# EAGLE design DataControlBoard-RPi (EAGLE 9.4.2)
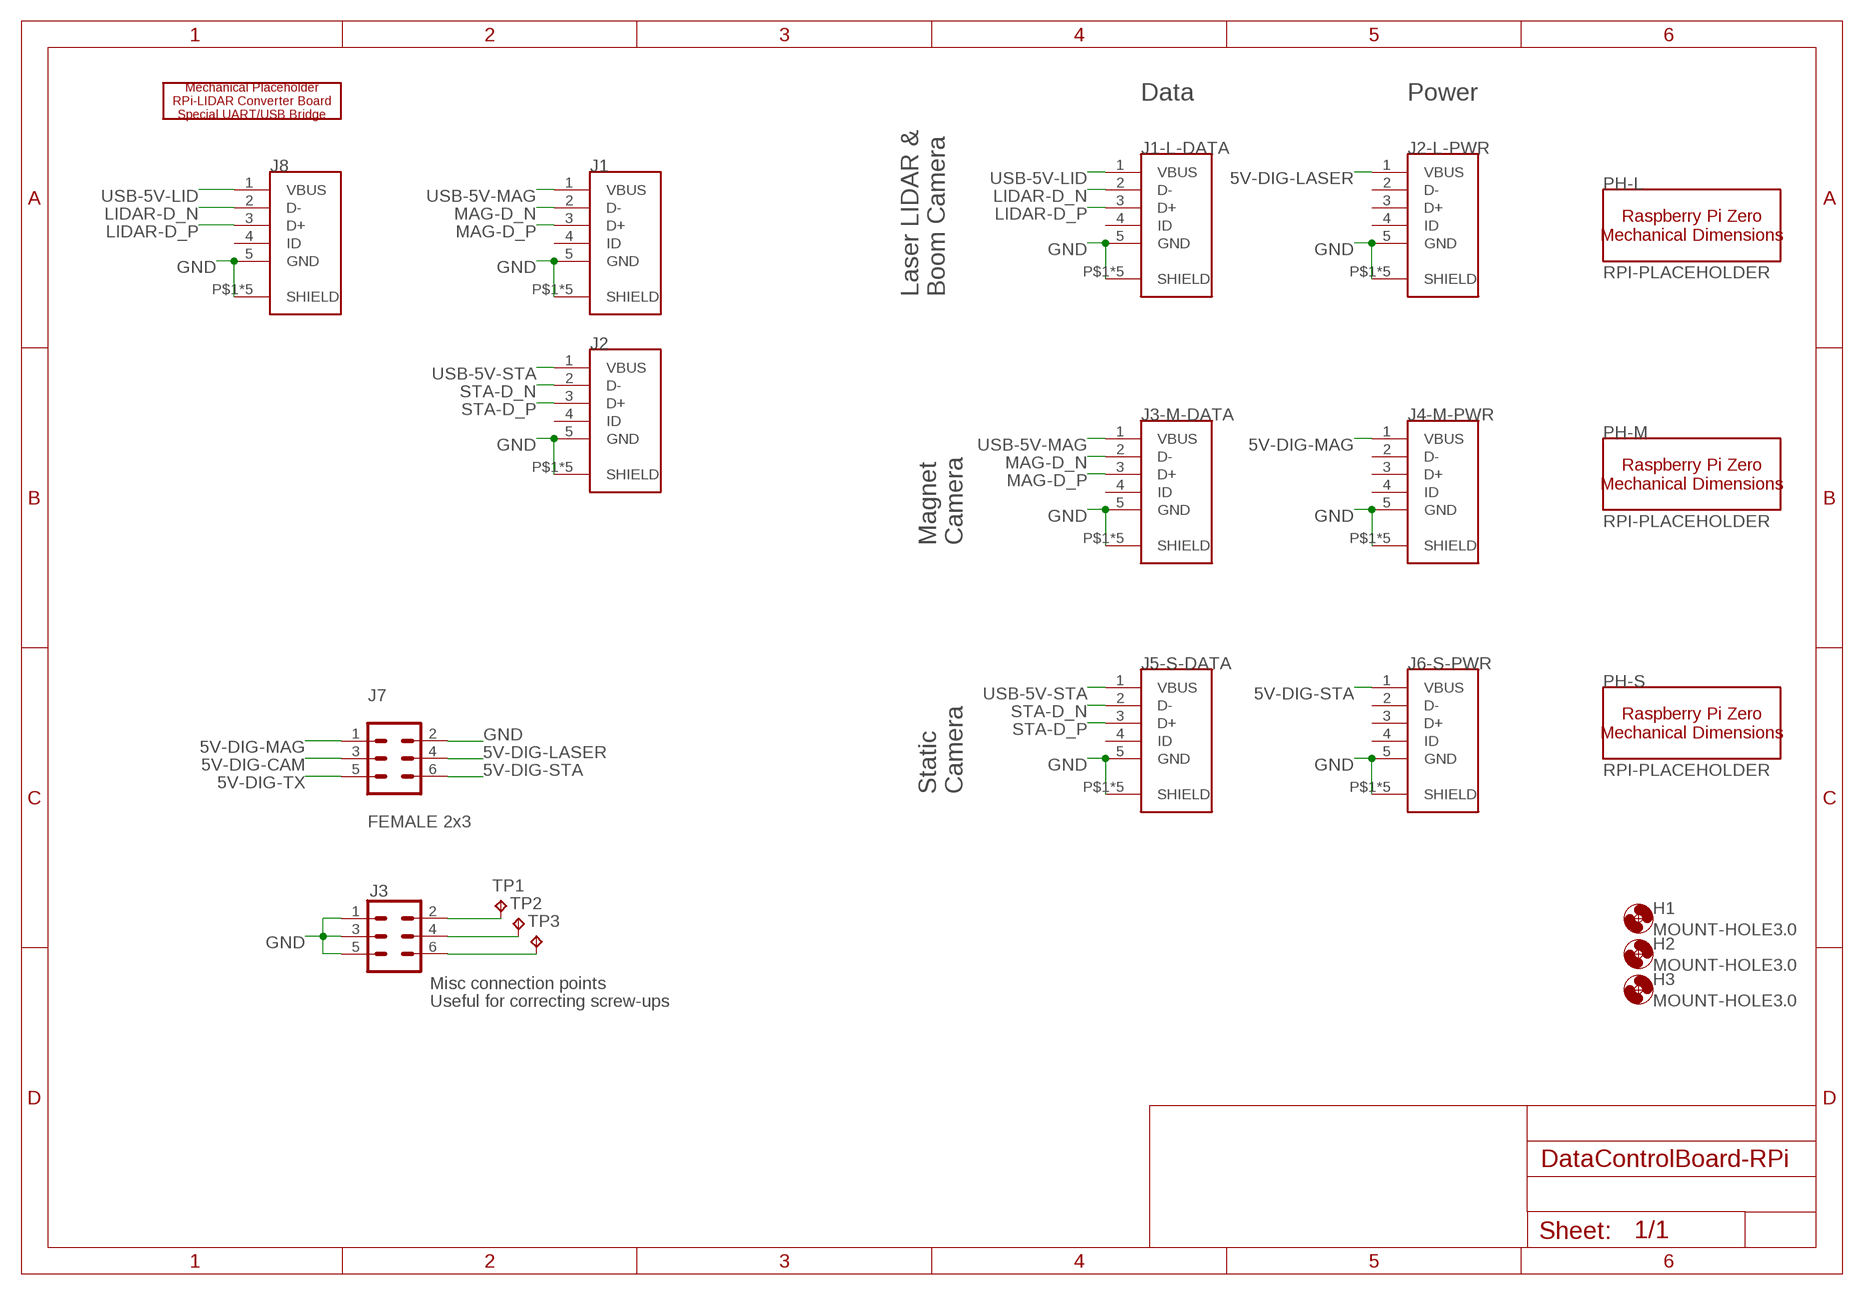
[diagram p0: schematic, sheet 1]

## Parts
H1  MOUNT-HOLE3.0  [3,0]
H2  MOUNT-HOLE3.0  [3,0]
H3  MOUNT-HOLE3.0  [3,0]
J1  USB3150-30-130-AMANUFACTURABLE  [GCT_USB3150-30-EASIER]
J1-L-DATA  USB3150-30-130-AMANUFACTURABLE  [GCT_USB3150-30-EASIER]
J2  USB3150-30-130-AMANUFACTURABLE  [GCT_USB3150-30-EASIER]
J2-L-PWR  USB3150-30-130-AMANUFACTURABLE  [GCT_USB3150-30-EASIER]
J3  CONN_03X22X3_SILK_MALE_PTH  [2X3]
J3-M-DATA  USB3150-30-130-AMANUFACTURABLE  [GCT_USB3150-30-EASIER]
J4-M-PWR  USB3150-30-130-AMANUFACTURABLE  [GCT_USB3150-30-EASIER]
J5-S-DATA  USB3150-30-130-AMANUFACTURABLE  [GCT_USB3150-30-EASIER]
J6-S-PWR  USB3150-30-130-AMANUFACTURABLE  [GCT_USB3150-30-EASIER]
J7  FEMALE 2x3  CONN_03X2FEMALE  [2X3]
J8  USB3150-30-130-AMANUFACTURABLE  [GCT_USB3150-30-EASIER]
PH-L  RPI-PLACEHOLDER  [RPI-ZERO-EDGE]
PH-M  RPI-PLACEHOLDER  [RPI-ZERO-EDGE]
PH-S  RPI-PLACEHOLDER  [RPI-ZERO-EDGE]
TP1  TPPAD1-17  [P1-17]
TP2  TPPAD1-17  [P1-17]
TP3  TPPAD1-17  [P1-17]
U$4  LIDAR-CONV-PLACEHOLDER  [LIDAR-PLACEHOLDER]

## Nets
5V-DIG-CAM: J7.3
5V-DIG-LASER: J2-L-PWR.1(VBUS) J7.4
5V-DIG-MAG: J4-M-PWR.1(VBUS) J7.1
5V-DIG-STA: J6-S-PWR.1(VBUS) J7.6
5V-DIG-TX: J7.5
GND: J1-L-DATA.5(GND) J1-L-DATA.P$1(SHIELD) J1-L-DATA.S3(SHIELD) J1-L-DATA.S4(SHIELD) J1-L-DATA.S5(SHIELD) J1-L-DATA.S6(SHIELD) J1.5(GND) J1.P$1(SHIELD) J1.S3(SHIELD) J1.S4(SHIELD) J1.S5(SHIELD) J1.S6(SHIELD) J2-L-PWR.5(GND) J2-L-PWR.P$1(SHIELD) J2-L-PWR.S3(SHIELD) J2-L-PWR.S4(SHIELD) J2-L-PWR.S5(SHIELD) J2-L-PWR.S6(SHIELD) J2.5(GND) J2.P$1(SHIELD) J2.S3(SHIELD) J2.S4(SHIELD) J2.S5(SHIELD) J2.S6(SHIELD) J3-M-DATA.5(GND) J3-M-DATA.P$1(SHIELD) J3-M-DATA.S3(SHIELD) J3-M-DATA.S4(SHIELD) J3-M-DATA.S5(SHIELD) J3-M-DATA.S6(SHIELD) J3.1 J3.3 J3.5 J4-M-PWR.5(GND) J4-M-PWR.P$1(SHIELD) J4-M-PWR.S3(SHIELD) J4-M-PWR.S4(SHIELD) J4-M-PWR.S5(SHIELD) J4-M-PWR.S6(SHIELD) J5-S-DATA.5(GND) J5-S-DATA.P$1(SHIELD) J5-S-DATA.S3(SHIELD) J5-S-DATA.S4(SHIELD) J5-S-DATA.S5(SHIELD) J5-S-DATA.S6(SHIELD) J6-S-PWR.5(GND) J6-S-PWR.P$1(SHIELD) J6-S-PWR.S3(SHIELD) J6-S-PWR.S4(SHIELD) J6-S-PWR.S5(SHIELD) J6-S-PWR.S6(SHIELD) J7.2 J8.5(GND) J8.P$1(SHIELD) J8.S3(SHIELD) J8.S4(SHIELD) J8.S5(SHIELD) J8.S6(SHIELD)
LIDAR-D_N [USB_diff]: J1-L-DATA.2(D-) J8.2(D-)
LIDAR-D_P [USB_diff]: J1-L-DATA.3(D+) J8.3(D+)
MAG-D_N [USB_diff]: J1.2(D-) J3-M-DATA.2(D-)
MAG-D_P [USB_diff]: J1.3(D+) J3-M-DATA.3(D+)
N$2: J3.2 TP1.TP
N$3: J3.4 TP2.TP
N$4: J3.6 TP3.TP
STA-D_N [USB_diff]: J2.2(D-) J5-S-DATA.2(D-)
STA-D_P [USB_diff]: J2.3(D+) J5-S-DATA.3(D+)
USB-5V-LID: J1-L-DATA.1(VBUS) J8.1(VBUS)
USB-5V-MAG: J1.1(VBUS) J3-M-DATA.1(VBUS)
USB-5V-STA: J2.1(VBUS) J5-S-DATA.1(VBUS)
Unconnected: J1-L-DATA.4(ID) J1.4(ID) J2-L-PWR.2(D-) J2-L-PWR.3(D+) J2-L-PWR.4(ID) J2.4(ID) J3-M-DATA.4(ID) J4-M-PWR.2(D-) J4-M-PWR.3(D+) J4-M-PWR.4(ID) J5-S-DATA.4(ID) J6-S-PWR.2(D-) J6-S-PWR.3(D+) J6-S-PWR.4(ID) J8.4(ID)

## Notes on the sheet
- Data | Power
- Laser LIDAR &
  Boom Camera
- Magnet 
  Camera
- Static
  Camera
- Misc connection points
- Useful for correcting screw-ups

## Library data of the parts
H1-H3 = holes:MOUNT-HOLE: MOUNTING HOLE with drill center marker
J1 J1-L-DATA J2 J2-L-PWR J3-M-DATA J4-M-PWR J5-S-DATA J6-S-PWR J8 = RPi-Parts:USB3150-30-130-A: Vertical Through Hole Type B Micro USB Plug w/ Shell Stakes and Pegs
J3 = SparkFun-Connectors:CONN_03X2: Multi connection point. Often used as Generic Header-pin footprint for 0.1 inch spaced/style header connections You can populate with any combo of single row headers, but if you'd like an exact match, check these: Header - 2x3 (Male, 0.1") <https://www.sparkfun.com/products/12807> (PRT-12807) Header - 2x3 (Female, 0.1") <https://www.sparkfun.com/products/13010> (PRT-13010) 2x3 Pin Shrouded Header <https://www.sparkfun.com/products/10877> (PRT-10877) On any of the 0.1 inch spaced packages, you can populate with these: Break Away Headers - Straight <https://www.sparkfun.com/products/116> (PRT-00116) Break Away Male Headers - Right Angle <https://www.sparkfun.com/products/553> (PRT-00553) Female Headers <https://www.sparkfun.com/products/115> (PRT-00115) Break Away Headers - Machine Pin <https://www.sparkfun.com/products/117> (PRT-00117) Break Away Female Headers - Swiss Machine Pin <https://www.sparkfun.com/products/743> (PRT-00743) Special note: the shrouded connector mates well with our 3x2 ribbon cables: Ribbon Crimp Connector - 6-pin (2x3, Female) <https://www.sparkfun.com/products/10651> (PRT-10651) Ribbon Cable - 6 wire (15ft) <https://www.sparkfun.com/products/10646> (PRT-10646); PROD_ID: CONN-09701
J7 = SparkFun-Connectors:CONN_03X2: Multi connection point. Often used as Generic Header-pin footprint for 0.1 inch spaced/style header connections You can populate with any combo of single row headers, but if you'd like an exact match, check these: Header - 2x3 (Male, 0.1") <https://www.sparkfun.com/products/12807> (PRT-12807) Header - 2x3 (Female, 0.1") <https://www.sparkfun.com/products/13010> (PRT-13010) 2x3 Pin Shrouded Header <https://www.sparkfun.com/products/10877> (PRT-10877) On any of the 0.1 inch spaced packages, you can populate with these: Break Away Headers - Straight <https://www.sparkfun.com/products/116> (PRT-00116) Break Away Male Headers - Right Angle <https://www.sparkfun.com/products/553> (PRT-00553) Female Headers <https://www.sparkfun.com/products/115> (PRT-00115) Break Away Headers - Machine Pin <https://www.sparkfun.com/products/117> (PRT-00117) Break Away Female Headers - Swiss Machine Pin <https://www.sparkfun.com/products/743> (PRT-00743) Special note: the shrouded connector mates well with our 3x2 ribbon cables: Ribbon Crimp Connector - 6-pin (2x3, Female) <https://www.sparkfun.com/products/10651> (PRT-10651) Ribbon Cable - 6 wire (15ft) <https://www.sparkfun.com/products/10646> (PRT-10646); PROD_ID: CONN-11566
PH-L PH-M PH-S = RPi-Parts:RPI-PLACEHOLDER: A part that shows the different mechanical constraints of a Raspberry Pi Zero when mounted on a board on-edge
TP1-TP3 = testpad:TP: Test pad
U$4 = RPi-Parts:LIDAR-CONV-PLACEHOLDER

## Board
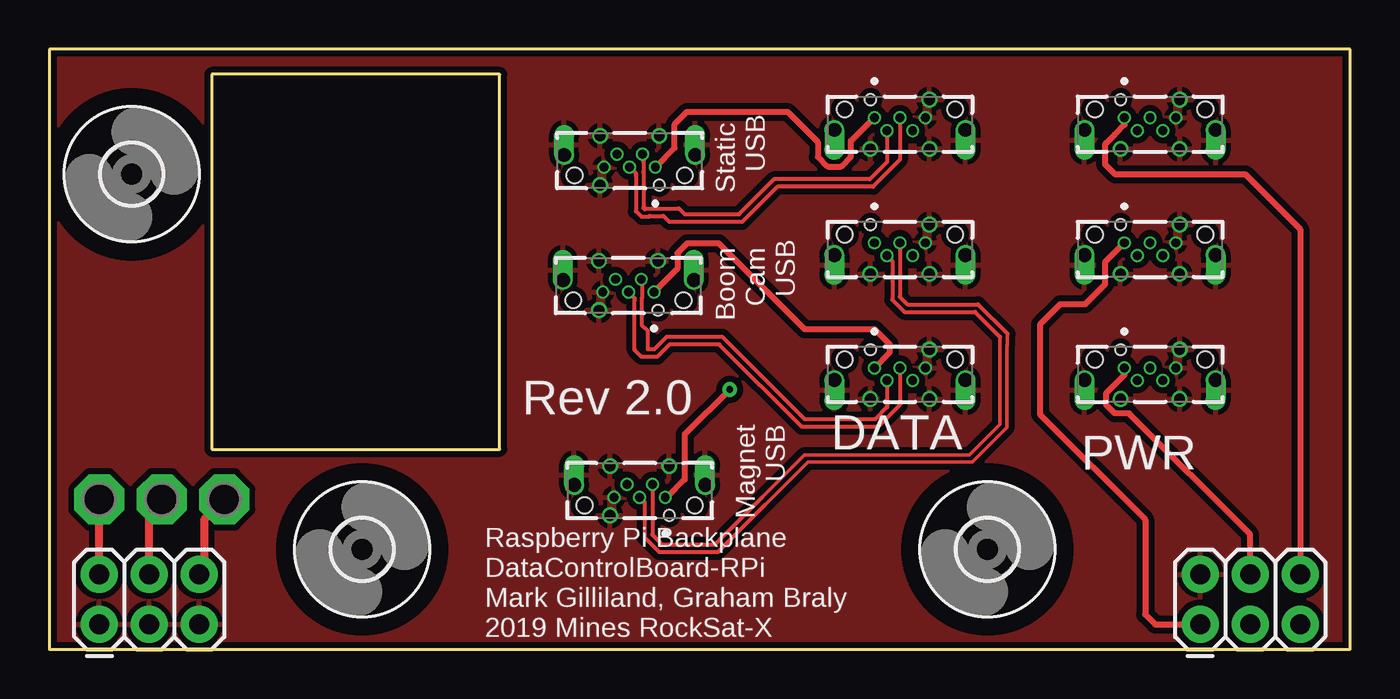
[diagram p1: board, top side]
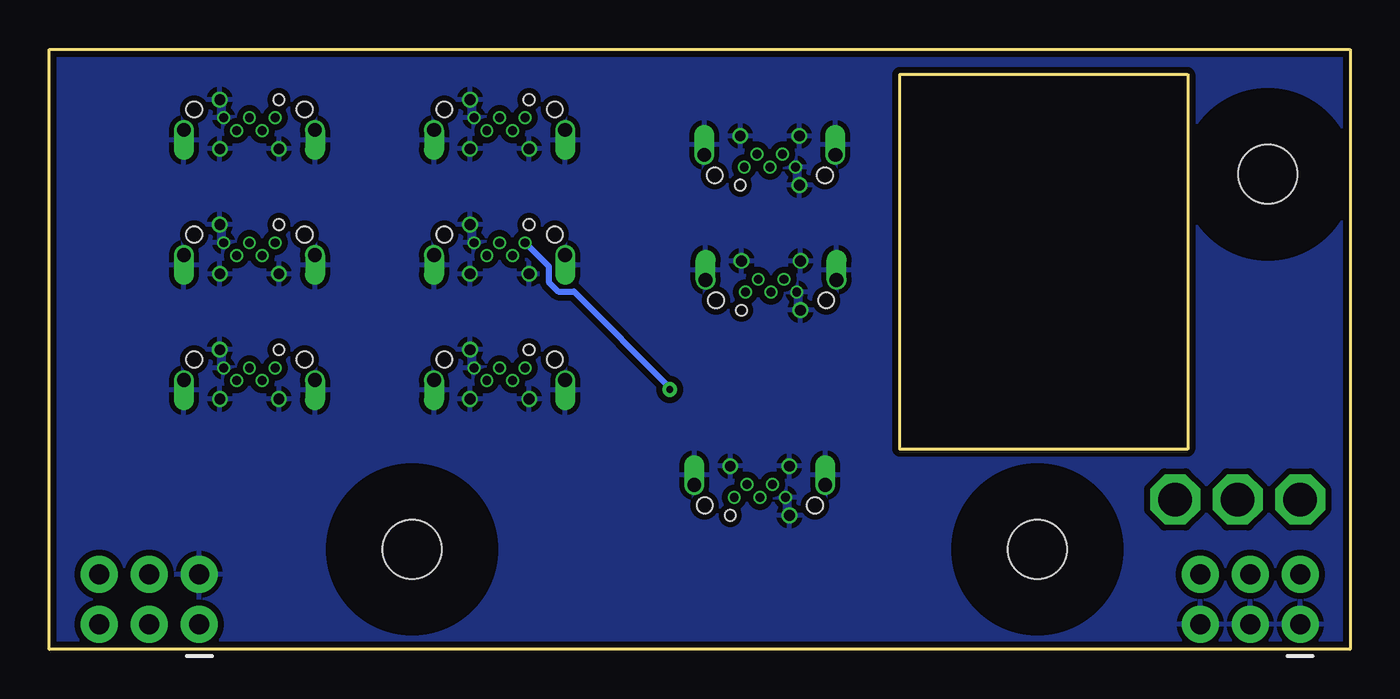
[diagram p2: board, bottom side, seen from below]

Size 66.04 x 30.48 mm. Coordinates in mm from the lower left corner, seen from the top.
Outline: 0,0 66.04,0 66.04,30.48 0,30.48 0,0
Outline: 8.26,29.21 8.26,10.16 22.86,10.16 22.86,29.21 8.26,29.21
Copper layers (1*16): Top 0.0356mm / dielectric 1.5011mm / Bottom 0.0356mm
Design rules "PCBway": minimum track width 7mil, minimum drill 10mil, track to track 7mil, track to pad 7mil, pad to pad 7mil, via to via 7mil, smd to smd 0mil, copper to edge 10mil, drill to drill 10mil, minimum pad ring 4mil, minimum via ring 8mil, stop-mask expansion 4mil, vias tented up to drill 0mil, thermal gap 10mil

### Footprints (pad centres in the part's own frame; a part is rotated, then mirrored left to right if it is on the bottom)
3,0 = hole 3: 0,0
GCT_USB3150-30-EASIER = drill 0.45 pad 0.635: 1 -1.3,0.65; 2 -0.65,0; 3 0,0.65; 4 0.65,0; 5 1.3,0.65 | drill 0.55 pad 0.813: P$1 1.499,1.57 | drill 0.55 pad 0.79: S3 -1.5,-0.93; S4 1.5,-0.93 | drill 0.7 pad 1.016 offset: S5 -3.325,0.03; S6 3.325,0.03 | hole 0.8: -2.8,1.07; 2.8,1.07 | hole 0.55: -1.499,1.57
2X3 = drill 1.016 pad 1.88: 1 0,0; 2 0,2.54; 3 2.54,0; 4 2.54,2.54; 5 5.08,0; 6 5.08,2.54
P1-17 = drill 1.702 pad 2.54 octagon: TP 0,0

### Placement (x,y rotation side)
H1  15.88,5.08 0 top
H2  47.62,5.08 0 top
H3  4.19,24.13 0 top
J1  29.97,8.38 180 top
J1-L-DATA  43.18,13.65 0 top
J2  29.46,25.15 180 top
J2-L-PWR  55.88,13.65 0 top
J3  2.54,1.27 0 top
J3-M-DATA  43.18,20 0 top
J4-M-PWR  55.88,20 0 top
J5-S-DATA  43.18,26.35 0 top
J6-S-PWR  55.88,26.35 0 top
J7  58.42,1.27 0 top
J8  29.4,18.8 180 top
PH-L  2.54,15.24 180 bottom
PH-M  2.54,21.59 180 bottom
PH-S  2.54,27.94 180 bottom
TP1  2.54,7.62 90 top
TP2  5.71,7.62 90 top
TP3  8.89,7.62 90 top
U$4  29.97,6.86 0 top

### Tracks (layer width: path | path; a pad name or v marks a point on that pad's centre or on a via)
5V-DIG-LASER
  Top 0.305: J2-L-PWR.1 54.58,13.95 53.66,13.02 53.66,12.42 54.08,12 54.8,12 60.96,5.84 J7.4
5V-DIG-MAG
  Top 0.305: J4-M-PWR.1 53.59,19.67 53.59,18.54 52.58,17.53 51.31,17.53 50.29,16.51 50.29,11.94 55.63,6.6 55.63,1.78 56.13,1.27 J7.1
5V-DIG-STA
  Top 0.305: J6-S-PWR.1 54.58,26.64 54.09,26.15 54.08,26.15 53.66,25.72 53.66,25.71 53.59,25.65 53.59,24.64 54.1,24.13 60.71,24.13 63.5,21.34 J7.6
GND
  pour Bottom (isolate 0.305): 66.04,0 0,0 0,30.48 66.04,30.48
  pour Top (isolate 0.305): 0,30.48 0,0 66.04,0 66.04,30.48
LIDAR-D_N
  Top 0.203: J1-L-DATA.2 42.53,12.3 41.91,11.68 38.35,11.68 34.16,15.88 31.34,15.88 30.7,15.24 30.38,15.24 30.38,16.16 30.1,16.45 30.1,17.89 30.09,17.89 30.09,18.4 30.1,18.4 30.1,18.75 J8.2
LIDAR-D_P
  Top 0.203: J1-L-DATA.3 43.18,12.41 42.07,11.3 38.2,11.3 34.01,15.49 31.5,15.49 30.86,14.86 30.07,14.86 29.72,15.21 29.72,17.73 29.71,17.74 29.71,17.83 J8.3
MAG-D_N
  Top 0.178: 36.2,7.75 38.33,9.88 46.71,9.88 48.26,11.43 48.26,15.88
  Top 0.203: J3-M-DATA.2 42.8,19.73 42.8,17.75 43.4,17.14 46.99,17.14 48.26,15.88 | J1.2 30.62,5.86 30.61,5.84 31.11,5.33 33.78,5.33 36.2,7.75
MAG-D_P
  Top 0.178: 36.35,7.37 38.51,9.53 46.86,9.53 48.62,11.28 48.62,15.24 48.62,15.47 48.63,15.47 48.63,15.65 48.64,15.66 48.64,16.03
  Top 0.203: J3-M-DATA.3 43.18,17.91 43.56,17.53 47.15,17.53 48.64,16.03 | J1.3 30.23,7.48 30.23,5.68 30.96,4.95 33.94,4.95 36.35,7.37
N$2
  Top 0.406: J3.2 TP1.TP
N$3
  Top 0.406: J3.4 5.08,6.99 TP2.TP
N$4
  Top 0.406: TP3.TP 7.87,6.6 7.87,4.06 J3.6
STA-D_N
  Top 0.203: J5-S-DATA.2 42.53,24.75 41.66,23.88 36.8,23.88 35.02,22.1 32.26,22.1 31.97,22.39 30.26,22.39 30.23,22.35 30.16,22.42 30.16,24.24 30.16,24.25 30.16,24.75 30.16,25.1 J2.2
STA-D_P
  Top 0.203: J5-S-DATA.3 43.18,24.86 41.81,23.5 36.96,23.5 35.18,21.72 31.47,21.72 31.18,22.01 30.48,22.01 30.44,21.97 30.07,21.97 29.78,22.26 29.78,24.08 29.78,24.09 29.78,24.18 J2.3
USB-5V-LID
  Top 0.305: J1-L-DATA.1 42.67,15.1 42.67,15.49 41.91,16.26 38.35,16.26 33.99,20.62 32.38,20.62 31.89,20.13 31.89,19.33 J8.1
USB-5V-MAG  (via drill 0.35)
  Top 0.305: v34.54,13.21 32.26,10.92 32.26,8.64 31.35,7.73 J1.1
  Bottom 0.305: v34.54,13.21 34.54,13.32 39.41,18.18 40.2,18.18 40.69,18.67 40.69,19.47 J3-M-DATA.1
USB-5V-STA
  Top 0.305: J2.1 31.75,25.48 31.75,26.67 32.38,27.3 37.47,27.3 39.02,25.75 39.02,25.02 39.51,24.53 40.2,24.53 40.69,25.02 40.69,25.82 J5-S-DATA.1

### Text on the board
tPlace: DATA | PWR
tNames: Static / USB | Boom / Cam / USB | Rev 2.0 | Magnet / USB | Raspberry Pi Backplane / DataControlBoard-RPi / Mark Gilliland, Graham Braly / 2019 Mines RockSat-X
tDocu: Static | Magnet | Boom / Cam | 1 2 3